# Altium schematic sheet Sensors.SchDoc: Project Sensor Connections
size Letter; Author: Suhas; CompanyName: Tech Musketeers; DrawnBy: Suhas Reddy; DocumentNumber: 1; Revision: 1; SheetNumber: 1; SheetTotal: 3
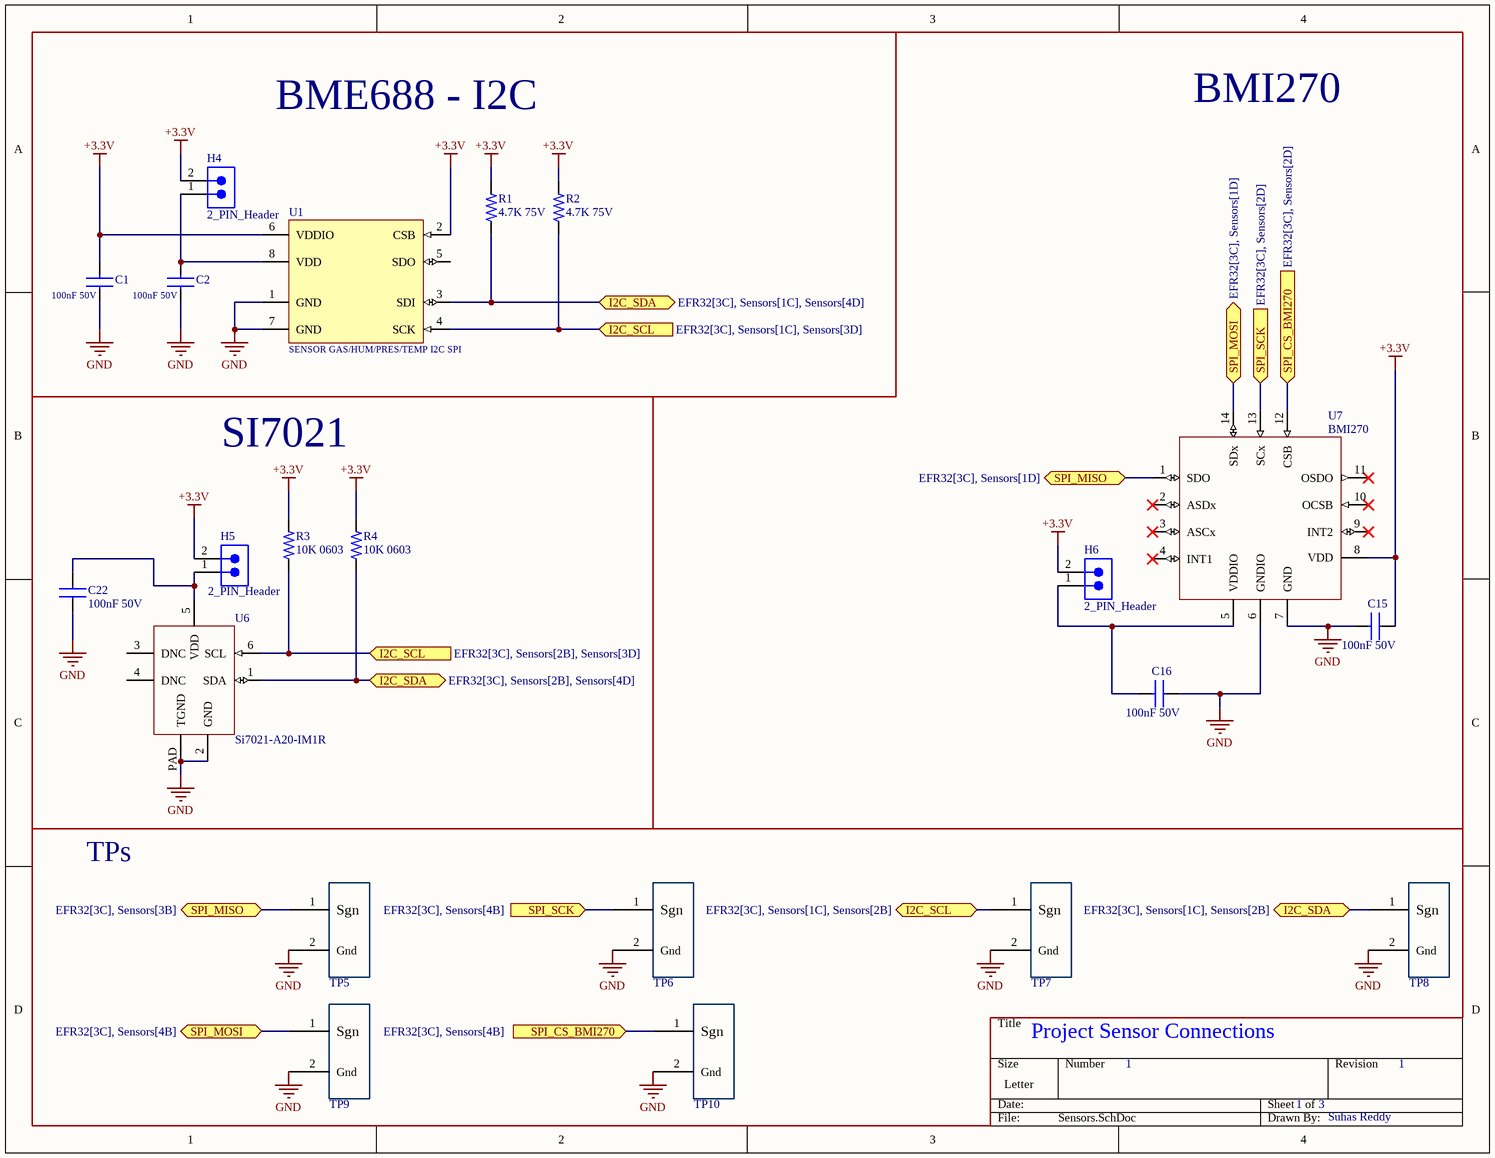
[diagram p0: Sensors.SchDoc]

## Parts
C1  100nF 50V  [CAP_0603_1MM]
C2  100nF 50V  [CAP_0603_1MM]
C15  100nF 50V  [CAP_0603_1MM]
C16  100nF 50V  [CAP_0603_1MM]
C22  100nF 50V  [CAP_0603_1MM]
H4  2_PIN_Header  [2-PIN_MALE_HEADER_01-IN]
H5  2_PIN_Header  [2-PIN_MALE_HEADER_01-IN]
H6  2_PIN_Header  [2-PIN_MALE_HEADER_01-IN]
R1  4.7K 75V  [RES_0603_1608X06]
R2  4.7K 75V  [RES_0603_1608X06]
R3  10K 0603  [RES_0603_1608X06]
R4  10K 0603  [RES_0603_1608X06]
TP5  TP_Active_Probe  [Active_Probe]  (value not drawn)
TP6  TP_Active_Probe  [Active_Probe]  (value not drawn)
TP7  TP_Active_Probe  [Active_Probe]  (value not drawn)
TP8  TP_Active_Probe  [Active_Probe]  (value not drawn)
TP9  TP_Active_Probe  [Active_Probe]  (value not drawn)
TP10  TP_Active_Probe  [Active_Probe]  (value not drawn)
U1  SENSOR GAS/HUM/PRES/TEMP I2C SPI  [LGA_8_300X300X100]
U6  Si7021-A20-IM1R  [6-QFN_3x3_Si7021]
U7  BMI270  [14-QFN_3x2.5_BMI270]

## Ports
I2C_SCL (bidir, see EFR32[3C], Sensors[1C], Sensors[2B]), I2C_SCL (in, see EFR32[3C], Sensors[1C], Sensors[3D]), I2C_SCL (in, see EFR32[3C], Sensors[2B], Sensors[3D]), I2C_SDA (bidir, see EFR32[3C], Sensors[1C], Sensors[2B]), I2C_SDA (bidir, see EFR32[3C], Sensors[1C], Sensors[4D]), I2C_SDA (bidir, see EFR32[3C], Sensors[2B], Sensors[4D]), SPI_CS_BMI270 (in, see EFR32[3C], Sensors[2D]), SPI_CS_BMI270 (in, see EFR32[3C], Sensors[4B]), SPI_MISO (bidir, see EFR32[3C], Sensors[1D]), SPI_MISO (bidir, see EFR32[3C], Sensors[3B]), SPI_MOSI (bidir, see EFR32[3C], Sensors[1D]), SPI_MOSI (bidir, see EFR32[3C], Sensors[4B]), SPI_SCK (in, see EFR32[3C], Sensors[2D]), SPI_SCK (in, see EFR32[3C], Sensors[4B])

## Nets
+3.3V: C1.1 C15.1 H4.2 H5.2 H6.2 R1.2 R2.2 R3.2 R4.2 U1.2(CSB) U1.6(VDDIO) U7.8(VDD)
GND: C1.2 C2.2 C15.2 C16.1 C22.2 TP5.2(Gnd) TP6.2(Gnd) TP7.2(Gnd) TP8.2(Gnd) TP9.2(Gnd) TP10.2(Gnd) U1.1(GND) U1.7(GND) U6.2(GND) U6.PAD(TGND) U7.6(GNDIO) U7.7(GND)
I2C_SCL: R2.1 R3.1 TP7.1(Sgn) U1.4(SCK) U6.6(SCL) ; port I2C_SCL
I2C_SDA: R1.1 R4.1 TP8.1(Sgn) U1.3(SDI) U6.1(SDA) ; port I2C_SDA
SPI_CS_BMI270: TP10.1(Sgn) U7.12(CSB) ; port SPI_CS_BMI270
SPI_MISO: TP5.1(Sgn) U7.1(SDO) ; port SPI_MISO
SPI_MOSI: TP9.1(Sgn) U7.14(SDx) ; port SPI_MOSI
SPI_SCK: TP6.1(Sgn) U7.13(SCx) ; port SPI_SCK
NetC2_1: C2.1 H4.1 U1.8(VDD)
NetC16_2: C16.2 H6.1 U7.5(VDDIO)
NetC22_1: C22.1 H5.1 U6.5(VDD)

Not connected (* = marked no-connect by the designer): U1 5(SDO); U6 3(DNC) 4(DNC); U7 2(ASDx)* 3(ASCx)* 4(INT1)* 9(INT2)* 10(OCSB)* 11(OSDO)*

## Notes on the sheet
- BME688 - I2C
- BMI270
- SI7021
- TPs

## Library data of the parts
C1 C2 = CC0603ZRY5V9BB104: Ceramic Capacitor, Multilayer, Ceramic, 50V, 80% +Tol, 20% -Tol, Y5V, -82/+22% TC, 0.1uF, Surface Mount, 0603; Manufacturer: Yageo; Multilayer: Yes; Supplier: Digikey; Supplier Part Number: 311-1343-1-ND; Manufacturer Part Number: CC0603ZRY5V9BB104; RoHS: Yes; Category: Ceramic Capacitors; Stock: 7870307; Pricing: 1=0.1, 10=0.028, 50=0.0162, 100=0.0125, 500=0.00944, 1000=0.00742 (USD); Mounting Technology: Surface Mount; Pins: 2; Dielectric Material: Ceramic; Package Shape: Rectangular; Case/Package: 0603; Terminal Finish: Nickel; Min Operating Temperature: -30°C; Max Operating Temperature: 85°C; JESD-609 Code: e3; Value: 100nF; Capacitor Type: Ceramic; Tolerance  (fill in as +-): 20%; Package Style: SMTMeter; Packaging: Tape and Reel; Tolerance (fill in as +-): 80%; Rated DC Voltage (URdc): 50V; Temperature Characteristics Code: Y5V; Termination: Wraparound; Length: 1.6mm; Width: 0.8mm; Height: 0.8mm; Reach SVHC Compliant: Yes; RoHS Compliant: Yes; ComponentLink1URL: https://datasheet.ciiva.com:443/pdfs/VipMasterIC/IC/YAGO/YAGO-S-A0004841839/YAGO-S-A0004841839-1.pdf?src-supplier=IHS+Markit; ComponentLink1Description: https://datasheet.ciiva.com:443/pdfs/VipMasterIC/IC/YAGO/YAGO-S-A0004841839/YAGO-S-A0004841839-1.pdf?src-supplier=IHS+Markit; ComponentLink2URL: https://datasheet.ciiva.com/144/mlccorderingcode-144027.pdf?src-supplier=Digikey; ComponentLink2Description: https://datasheet.ciiva.com/144/mlccorderingcode-144027.pdf?src-supplier=Digikey; ComponentLink3URL: https://datasheet.ciiva.com/11786/0900766b8079c870-11786029.pdf?src-supplier=Rs; ComponentLink3Description: https://datasheet.ciiva.com/11786/0900766b8079c870-11786029.pdf?src-supplier=Rs; ComponentLink4URL: https://datasheet.ciiva.com/144/mlccorderingcode-144025.pdf?src-supplier=Digikey; ComponentLink4Description: https://datasheet.ciiva.com/144/mlccorderingcode-144025.pdf?src-supplier=Digikey; ComponentLink5URL: https://datasheet.ciiva.com/144/mlccorderingcode-144026.pdf?src-supplier=Digikey; ComponentLink5Description: https://datasheet.ciiva.com/144/mlccorderingcode-144026.pdf?src-supplier=Digikey; ComponentLink6URL: https://datasheet.ciiva.com/5427/upy-gphc-y5v-6-3v-to-50v-5-5427420.pdf?src-supplier=Mouser; ComponentLink6Description: https://datasheet.ciiva.com/5427/upy-gphc-y5v-6-3v-to-50v-5-5427420.pdf?src-supplier=Mouser; ComponentLink7URL: https://datasheet.ciiva.com/28450/1132289-28450702.pdf?src-supplier=Element14; ComponentLink7Description: https://datasheet.ciiva.com/28450/1132289-28450702.pdf?src-supplier=Element14; ComponentLink8URL: https://datasheet.ciiva.com/26829/getdatasheetpartid-403611-26829467.pdf?src-supplier=Verical; ComponentLink8Description: https://datasheet.ciiva.com/26829/getdatasheetpartid-403611-26829467.pdf?src-supplier=Verical
C15 C16 C22 = CC_0.1uF_0603_ZRY5V9BB104: Ceramic Capacitor, Multilayer, Ceramic, 50V, 80% +Tol, 20% -Tol, Y5V, -82/+22% TC, 0.1uF, Surface Mount, 0603; Manufacturer: Yageo; Manufacturer Part Number: CC0603ZRY5V9BB104; Multilayer: Yes; Supplier: Digikey; Supplier Part Number: 311-1343-1-ND; RoHS: Yes; Category: Ceramic Capacitors; Stock: 7870307; Pricing: 1=0.1, 10=0.028, 50=0.0162, 100=0.0125, 500=0.00944, 1000=0.00742 (USD); Mounting Technology: Surface Mount; Pins: 2; Dielectric Material: Ceramic; Package Shape: Rectangular; Case/Package: 0603; Terminal Finish: Nickel; Min Operating Temperature: -30°C; Max Operating Temperature: 85°C; JESD-609 Code: e3; Value: 100nF; Capacitor Type: Ceramic; Tolerance  (fill in as +-): 20%; Package Style: SMTMeter; Packaging: Tape and Reel; Tolerance (fill in as +-): 80%; Rated DC Voltage (URdc): 50V; Temperature Characteristics Code: Y5V; Termination: Wraparound; Length: 1.6mm; Width: 0.8mm; Height: 0.8mm; Reach SVHC Compliant: Yes; RoHS Compliant: Yes; ComponentLink1URL: https://datasheet.ciiva.com:443/pdfs/VipMasterIC/IC/YAGO/YAGO-S-A0004841839/YAGO-S-A0004841839-1.pdf?src-supplier=IHS+Markit; ComponentLink1Description: https://datasheet.ciiva.com:443/pdfs/VipMasterIC/IC/YAGO/YAGO-S-A0004841839/YAGO-S-A0004841839-1.pdf?src-supplier=IHS+Markit; ComponentLink2URL: https://datasheet.ciiva.com/144/mlccorderingcode-144027.pdf?src-supplier=Digikey; ComponentLink2Description: https://datasheet.ciiva.com/144/mlccorderingcode-144027.pdf?src-supplier=Digikey; ComponentLink3URL: https://datasheet.ciiva.com/11786/0900766b8079c870-11786029.pdf?src-supplier=Rs; ComponentLink3Description: https://datasheet.ciiva.com/11786/0900766b8079c870-11786029.pdf?src-supplier=Rs; ComponentLink4URL: https://datasheet.ciiva.com/144/mlccorderingcode-144025.pdf?src-supplier=Digikey; ComponentLink4Description: https://datasheet.ciiva.com/144/mlccorderingcode-144025.pdf?src-supplier=Digikey; ComponentLink5URL: https://datasheet.ciiva.com/144/mlccorderingcode-144026.pdf?src-supplier=Digikey; ComponentLink5Description: https://datasheet.ciiva.com/144/mlccorderingcode-144026.pdf?src-supplier=Digikey; ComponentLink6URL: https://datasheet.ciiva.com/5427/upy-gphc-y5v-6-3v-to-50v-5-5427420.pdf?src-supplier=Mouser; ComponentLink6Description: https://datasheet.ciiva.com/5427/upy-gphc-y5v-6-3v-to-50v-5-5427420.pdf?src-supplier=Mouser; ComponentLink7URL: https://datasheet.ciiva.com/28450/1132289-28450702.pdf?src-supplier=Element14; ComponentLink7Description: https://datasheet.ciiva.com/28450/1132289-28450702.pdf?src-supplier=Element14; ComponentLink8URL: https://datasheet.ciiva.com/26829/getdatasheetpartid-403611-26829467.pdf?src-supplier=Verical; ComponentLink8Description: https://datasheet.ciiva.com/26829/getdatasheetpartid-403611-26829467.pdf?src-supplier=Verical
H4-H6 = PRPC002SAAN-RC: CONN HEADER VERT 2POS 2.54MM; Manufacturer: Sullins; Connector Type: Header, Unshrouded, Breakaway; Number of Positions: 2; Number of Positions Loaded: All; Pitch: 0.100" (2.54mm); Online Catalog: 0.100" (2.54mm) Pitch Connector Headers; Other Names: S9510E-02  S9510E-02-ND; Supplier 1: Digi-Key; Manufacturer Part Number: PRPC002SAAN-RC; Stock 1: 42739; Pricing 1: 1=0.08, 10=0.073, 25=0.054, 50=0.0464, 100=0.0449, 250=0.0387, 500=0.0372 (USD); Standard Package: 1; Category: Connectors, Interconnects; Family: Rectangular Connectors - Headers, Male Pins; Series: -; Packaging: Bulk; Contact Type: Male Pin; Number of Rows: 1; Row Spacing: -; Contact Mating Length: 0.230" (5.84mm); Mounting Type: Through Hole; Termination: Solder; Fastening Type: -; Features: -; Contact Finish: Gold; Contact Finish Thickness: Flash; Color: Black; ComponentLink1URL: https://media.digikey.com/PDF/Data%20Sheets/Sullins%20PDFs/xRxCzzzSxxN-RC_ST_11635-B.pdf?src-supplier=Digi-Key; ComponentLink1Description: https://media.digikey.com/PDF/Data%20Sheets/Sullins%20PDFs/xRxCzzzSxxN-RC_ST_11635-B.pdf?src-supplier=Digi-Key; Supplier Part Number 1: S1011EC-02-ND
R1 R2 = RMCF0603FT4K70: Fixed Resistor, Metal Glaze/thick Film, 0.1W, 4700ohm, 75V, 1% +/-Tol, 100ppm/Cel, Surface Mount, 0603; Manufacturer: Stackpole Electronics; Power: 100mW; Rated Temperature: 70°C; Value: 4.7kR; Temperature Coefficient: 100ppm/°C; Package Height: 0.45mm; Package Length: 1.55mm; Package Width: 0.8mm; Reference Standard: AEC-Q200; Supplier: Digikey; Supplier Part Number: RMCF0603FT4K70CT-ND; Manufacturer Part Number: RMCF0603FT4K70; RoHS: Yes; Category: Chip SMD Resistors; Stock: 2225898; Pricing: 1=0.1, 10=0.015, 50=0.009, 100=0.0075, 500=0.00498, 1000=0.00425 (USD); Mounting Technology: Surface Mount; Pins: 2; Package Shape: Rectangular; Case/Package: 0603; Terminal Finish: Nickel; Min Operating Temperature: -55°C; Max Operating Temperature: 155°C; Tolerance: 1%; JESD-609 Code: e3; Resistor Type: FIXED RESISTOR; Construction: Rectangular; Package Style: SMTMeter; Packaging: Tape and Reel; Technology: METAL GLAZE/THICK FILM; Termination: Wraparound; Working Voltage: 75V; Reach SVHC Compliant: Yes; RoHS Compliant: Yes; ComponentLink1URL: https://datasheet.ciiva.com:443/pdfs/VipMasterIC/IC/SEIE/SEIE-S-A0009541969/SEIE-S-A0009541969-1.pdf?src-supplier=IHS+Markit; ComponentLink1Description: https://datasheet.ciiva.com:443/pdfs/VipMasterIC/IC/SEIE/SEIE-S-A0009541969/SEIE-S-A0009541969-1.pdf?src-supplier=IHS+Markit; ComponentLink2URL: https://datasheet.ciiva.com/26835/getdatasheetpartid-486078-26835642.pdf?src-supplier=Verical; ComponentLink2Description: https://datasheet.ciiva.com/26835/getdatasheetpartid-486078-26835642.pdf?src-supplier=Verical
R3 R4 = RC0603FR-0710KL: Fixed Resistor, Metal Glaze/thick Film, 0.1W, 10000ohm, 75V, 1% +/-Tol, 100ppm/Cel, Surface Mount, 0603; Manufacturer: Yageo; Additional Feature: LASER TRIMMABLE; Power: 100mW; Rated Temperature: 70°C; Value: 10kR; Temperature Coefficient: 100ppm/°C; Package Height: 0.45mm; Package Length: 1.6mm; Package Width: 0.8mm; Supplier: Digikey; Supplier Part Number: 311-10.0KHRCT-ND; Manufacturer Part Number: RC0603FR-0710KL; RoHS: Yes; Category: Chip SMD Resistors; Stock: 6848888; Pricing: 1=0.1, 10=0.019, 50=0.0112, 100=0.0093, 500=0.00622, 1000=0.00532, 5000=0.00382, 10000=0.00335, 25000=0.00287, 35000=0.00278, 50000=0.00257, 125000=0.00232 (USD); Mounting Technology: Surface Mount; Pins: 2; Package Shape: Rectangular; Case/Package: 0603; Terminal Finish: Nickel; Min Operating Temperature: -55°C; Max Operating Temperature: 155°C; Tolerance: 1%; JESD-609 Code: e3; Resistor Type: FIXED RESISTOR; Construction: Chip; Package Style: SMTMeter; Packaging: Tape and Reel; Technology: METAL GLAZE/THICK FILM; Termination: Wraparound; Working Voltage: 75V; Reach SVHC Compliant: Yes; RoHS Compliant: Yes; ComponentLink1URL: https://datasheet.ciiva.com:443/pdfs/VipMasterIC/IC/YAGO/YAGO-S-A0008145938/YAGO-S-A0008145938-1.pdf?src-supplier=IHS+Markit; ComponentLink1Description: https://datasheet.ciiva.com:443/pdfs/VipMasterIC/IC/YAGO/YAGO-S-A0008145938/YAGO-S-A0008145938-1.pdf?src-supplier=IHS+Markit; ComponentLink2URL: http://www.farnell.com/datasheets/2167052.pdf?src-supplier=Farnell; ComponentLink2Description: http://www.farnell.com/datasheets/2167052.pdf?src-supplier=Farnell; ComponentLink3URL: http://www.farnell.com/datasheets/1868787.pdf?src-supplier=Farnell; ComponentLink3Description: http://www.farnell.com/datasheets/1868787.pdf?src-supplier=Farnell; ComponentLink4URL: http://www.farnell.com/datasheets/443971.pdf?src-supplier=Farnell; ComponentLink4Description: http://www.farnell.com/datasheets/443971.pdf?src-supplier=Farnell; ComponentLink5URL: http://www.yageo.com/documents/recent/PYu-RC_Group_51_RoHS_L_10.pdf?src-supplier=Digikey; ComponentLink5Description: http://www.yageo.com/documents/recent/PYu-RC_Group_51_RoHS_L_10.pdf?src-supplier=Digikey; ComponentLink6URL: http://www.yageo.com/documents/recent/PYu-RC_Group_51_RoHS_L_9.pdf?src-supplier=Component+Sense; ComponentLink6Description: http://www.yageo.com/documents/recent/PYu-RC_Group_51_RoHS_L_9.pdf?src-supplier=Component+Sense
TP5-TP10 = TP_Active_Probe: Active Probe Test Point footprint
U1 = BME688: Gas, Pressure, Temperature and Humidity Sensor Digital Output 1.8V 8-Pin LGA Reel; Manufacturer: Bosch Tools; Supplier: Digikey; Supplier Part Number: 828-BME688CT-ND; Manufacturer Part Number: BME688; RoHS: No; Category: Temperature and Humidity Sensors; Stock: 11321; Pricing: 1=11.83, 10=9.466, 25=8.756, 100=7.5729, 500=7.0996, 1000=6.6263, 6000=6.29499 (USD)
U6 = Si7021-A20-IM1R: Serial Switch/Digital Sensor, 14 Bit(s), 0.40Cel, Square, Surface Mount; Manufacturer: Silicon Labs; Accuracy-Max (Cel): 0.4°C; Number of Bits: 14; Operating Current-Max: 4mA; Output Interface Type: I2C; Sensor Type: TEMPERATURE SENSOR,SWITCH/DIGITAL OUTPUT,SERIAL; Max Supply Voltage: 3.6V; Min Supply Voltage: 1.9V; Body Breadth: 3inch; Body Height: 1.21mm; Body Length or Diameter: 3mm; Supplier: Digikey; Supplier Part Number: 336-4349-1-ND; Manufacturer Part Number: SI7021-A20-IM1R; RoHS: Yes; Category: Temperature and Humidity Sensors; Stock: 4173; Pricing: 1=10.91, 10=8.726, 25=8.072, 100=6.9811, 500=6.5448, 1000=6.10848 (USD); Mounting Technology: Surface Mount; Package Shape/Style: Square; Terminal Finish: Nickel; Min Operating Temperature: -40°C; Max Operating Temperature: 125°C; JESD-609 Code: e4; Termination: Solder; Reach SVHC Compliant: Yes; RoHS Compliant: Yes; ComponentLink1URL: https://datasheet.ciiva.com:443/pdfs/VipMasterIC/IC/SILC/SILC-S-A0009375758/SILC-S-A0009375758-1.pdf?src-supplier=IHS+Markit; ComponentLink1Description: https://datasheet.ciiva.com:443/pdfs/VipMasterIC/IC/SILC/SILC-S-A0009375758/SILC-S-A0009375758-1.pdf?src-supplier=IHS+Markit; ComponentLink2URL: https://www.silabs.com/Support%20Documents%2fTechnicalDocs%2fSi7021-A20.pdf?src-supplier=Digikey; ComponentLink2Description: https://www.silabs.com/Support%20Documents%2fTechnicalDocs%2fSi7021-A20.pdf?src-supplier=Digikey; ComponentLink3URL: https://www.silabs.com/Support%20Documents/TechnicalDocs/Si7021-A20.pdf?src-supplier=Avnet; ComponentLink3Description: https://www.silabs.com/Support%20Documents/TechnicalDocs/Si7021-A20.pdf?src-supplier=Avnet; ComponentLink4URL: https://www.silabs.com/documents/public/data-sheets/Si7021-A20.pdf?src-supplier=Digikey; ComponentLink4Description: https://www.silabs.com/documents/public/data-sheets/Si7021-A20.pdf?src-supplier=Digikey
U7 = BMI270: BMI270 Series 3.6 V 685 µA Smart Ultra-low Power Inertial Measurement Unit; Manufacturer: Bosch Tools; Supplier: Digikey; Supplier Part Number: 828-1091-1-ND; Manufacturer Part Number: BMI270; RoHS: No; Category: Linear ICs; Stock: 6145; Pricing: 1=5.88, 10=4.409, 25=3.9188, 50=3.7228, 100=3.6249, 500=3.03708, 1000=2.84113, 5000=2.64519 (USD)